# EAGLE design B113A (EAGLE 6.6.0)
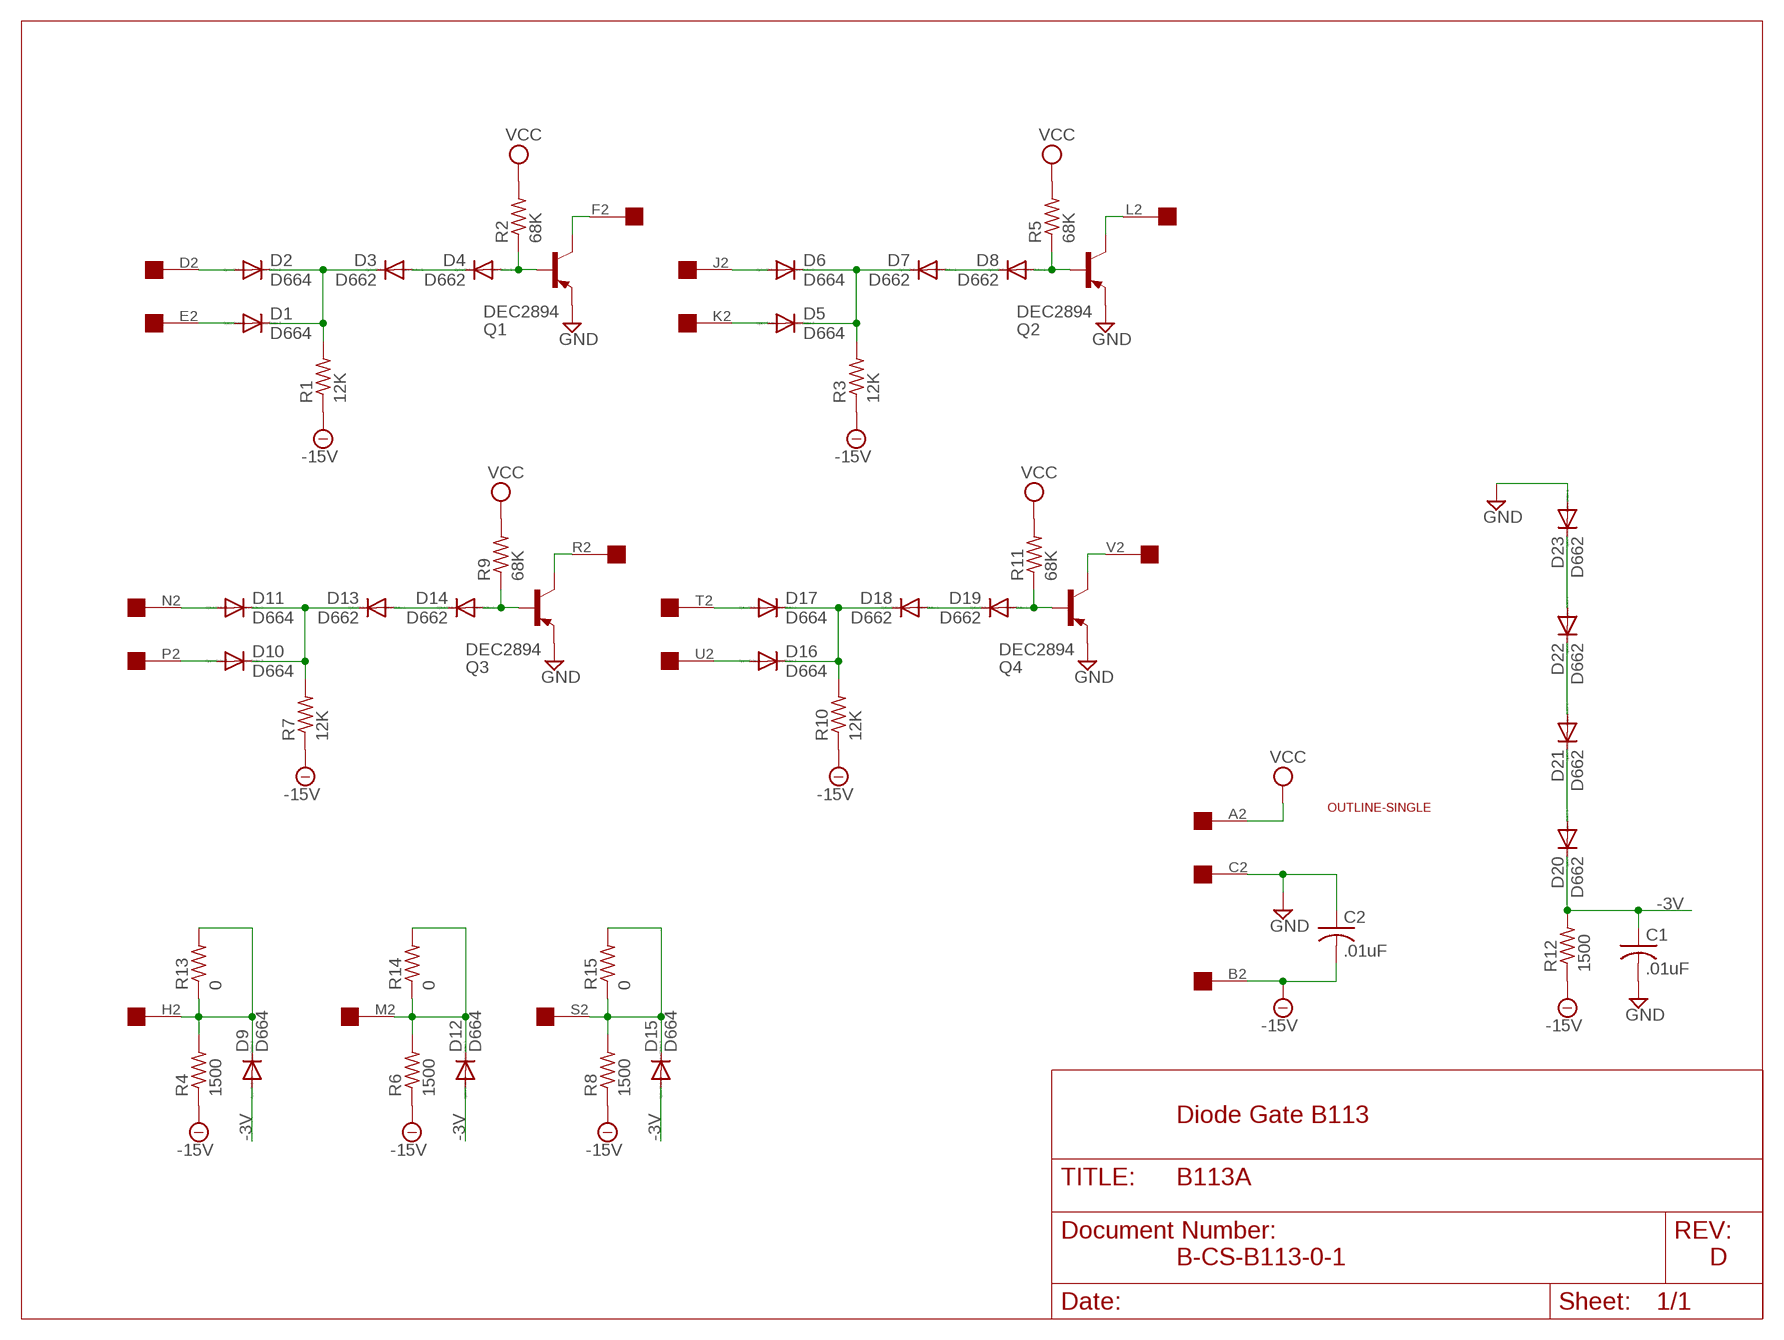
[diagram p0: schematic, sheet 1]

## Parts
C1  .01uF  C-US  [C063-025X075]
C2  .01uF  C-US  [C063-025X075]
D1  D664  DIODE-DO35-10  [DO35-10]
D2  D664  DIODE-DO35-10  [DO35-10]
D3  D662  DIODE-DO35-10  [DO35-10]
D4  D662  DIODE-DO35-10  [DO35-10]
D5  D664  DIODE-DO35-10  [DO35-10]
D6  D664  DIODE-DO35-10  [DO35-10]
D7  D662  DIODE-DO35-10  [DO35-10]
D8  D662  DIODE-DO35-10  [DO35-10]
D9  D664  DIODE-DO35-10  [DO35-10]
D10  D664  DIODE-DO35-10  [DO35-10]
D11  D664  DIODE-DO35-10  [DO35-10]
D12  D664  DIODE-DO35-10  [DO35-10]
D13  D662  DIODE-DO35-10  [DO35-10]
D14  D662  DIODE-DO35-10  [DO35-10]
D15  D664  DIODE-DO35-10  [DO35-10]
D16  D664  DIODE-DO35-10  [DO35-10]
D17  D664  DIODE-DO35-10  [DO35-10]
D18  D662  DIODE-DO35-10  [DO35-10]
D19  D662  DIODE-DO35-10  [DO35-10]
D20  D662  DIODE-DO35-10  [DO35-10]
D21  D662  DIODE-DO35-10  [DO35-10]
D22  D662  DIODE-DO35-10  [DO35-10]
D23  D662  DIODE-DO35-10  [DO35-10]
Q1  DEC2894  -PNP-TO5  [TO5]
Q2  DEC2894  -PNP-TO5  [TO5]
Q3  DEC2894  -PNP-TO5  [TO5]
Q4  DEC2894  -PNP-TO5  [TO5]
R1  12K  R-US_0207/10  [0207/10]
R2  68K  R-US_0207/10  [0207/10]
R3  12K  R-US_0207/10  [0207/10]
R4  1500  R-US_0207/10  [0207/10]
R5  68K  R-US_0207/10  [0207/10]
R6  1500  R-US_0207/10  [0207/10]
R7  12K  R-US_0207/10  [0207/10]
R8  1500  R-US_0207/10  [0207/10]
R9  68K  R-US_0207/10  [0207/10]
R10  12K  R-US_0207/10  [0207/10]
R11  68K  R-US_0207/10  [0207/10]
R12  1500  R-US_0207/10  [0207/10]
R13  0  R-US_0207/10  [0207/10]
R14  0  R-US_0207/10  [0207/10]
R15  0  R-US_0207/10  [0207/10]
U$1  OUTLINE-SINGLE  [SINGLE]
U$2  EDGE-1  [EDGE-CON1]

## Nets
-3V: C1.1 D9.A D12.A D15.A D20.C R12.2
-15V: C2.2 R1.1 R3.1 R4.1 R6.1 R7.1 R8.1 R10.1 R12.1 U$2.B2
GND: C1.2 C2.1 D23.A Q1.1(E) Q2.1(E) Q3.1(E) Q4.1(E) U$2.C2
N$1: D2.A U$2.D2
N$2: D1.C D2.C D3.C R1.2
N$3: D3.A D4.C
N$4: D1.A U$2.E2
N$5: D4.A Q1.2(B) R2.1
N$6: Q1.3(C) U$2.F2
N$7: D9.C R4.2 R13.1 R13.2 U$2.H2
N$8: D12.C R6.2 R14.1 R14.2 U$2.M2
N$9: D15.C R8.2 R15.1 R15.2 U$2.S2
N$10: D6.A U$2.J2
N$11: D5.C D6.C D7.C R3.2
N$12: D7.A D8.C
N$13: D5.A U$2.K2
N$14: D8.A Q2.2(B) R5.1
N$15: Q2.3(C) U$2.L2
N$16: D11.A U$2.N2
N$17: D10.C D11.C D13.C R7.2
N$18: D13.A D14.C
N$19: D10.A U$2.P2
N$20: D14.A Q3.2(B) R9.1
N$21: Q3.3(C) U$2.R2
N$22: D17.A U$2.T2
N$23: D16.C D17.C D18.C R10.2
N$24: D18.A D19.C
N$25: D16.A U$2.U2
N$26: D19.A Q4.2(B) R11.1
N$27: Q4.3(C) U$2.V2
N$28: D22.A D23.C
N$29: D21.A D22.C
N$31: D20.A D21.C
VCC: R2.2 R5.2 R9.2 R11.2 U$2.A2

## Notes on the sheet
- Diode Gate B113
- B-CS-B113-0-1 | D

## Library data of the parts
C1 C2 = dec-con:C-US: Capacitors with funky DEC lead spacing.
D1-D23 = diode:DIODE-: DIODE
Q1-Q4 = transistor:*-PNP-: PNP Transistror
R1-R15 = rcl:R-US_: RESISTOR, American symbol
U$1 = dec-con:OUTLINE-*: Board outlines for DEC boards.
U$2 = dec-con:EDGE-1: Single-Sided DEC Edge Connector -- (side 2)

## Net classes
0 default: width 0.813 mm

## Board
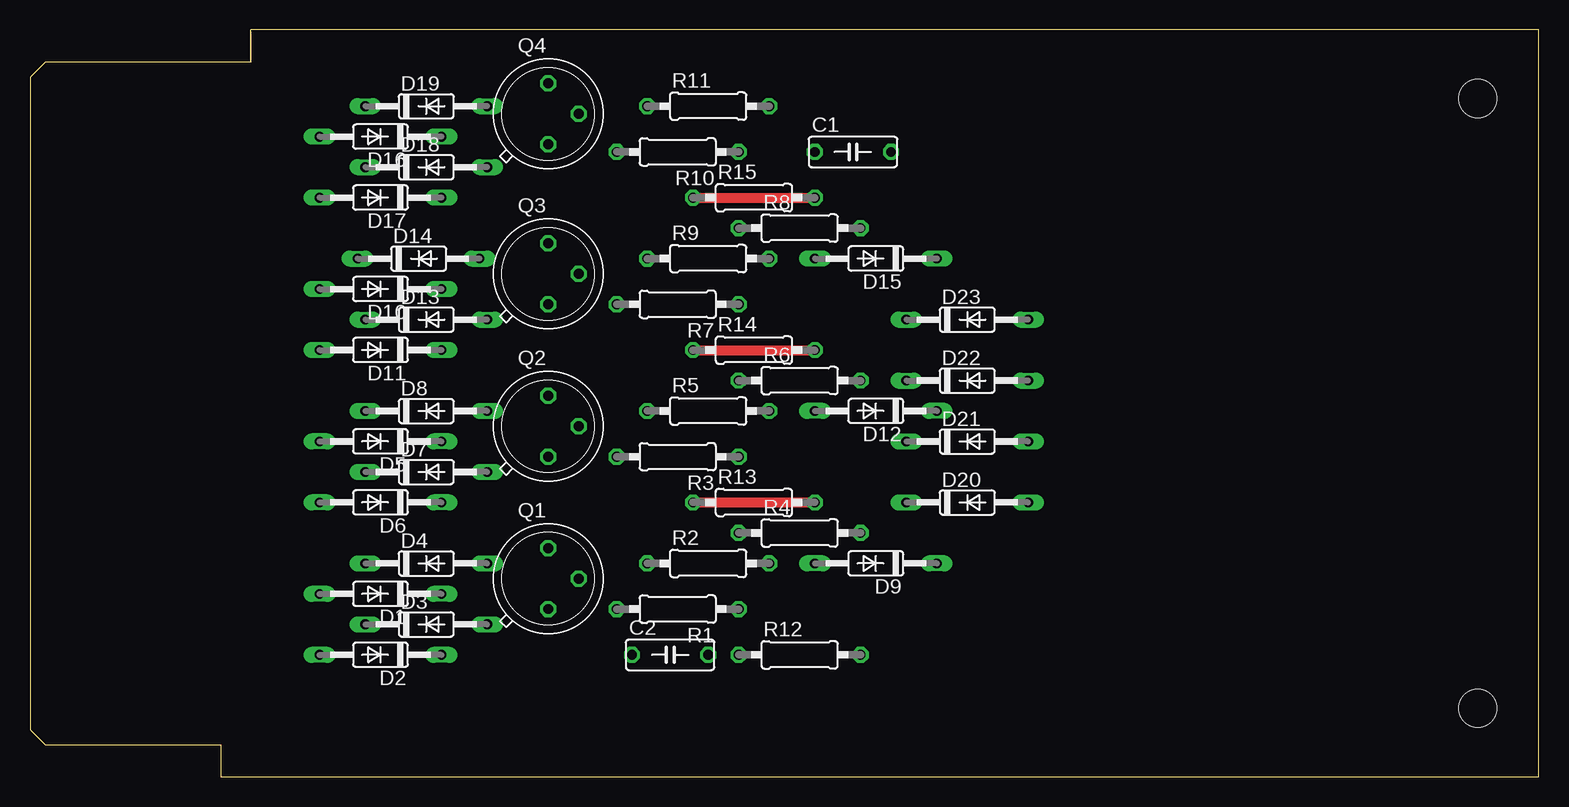
[diagram p1: board, top side]
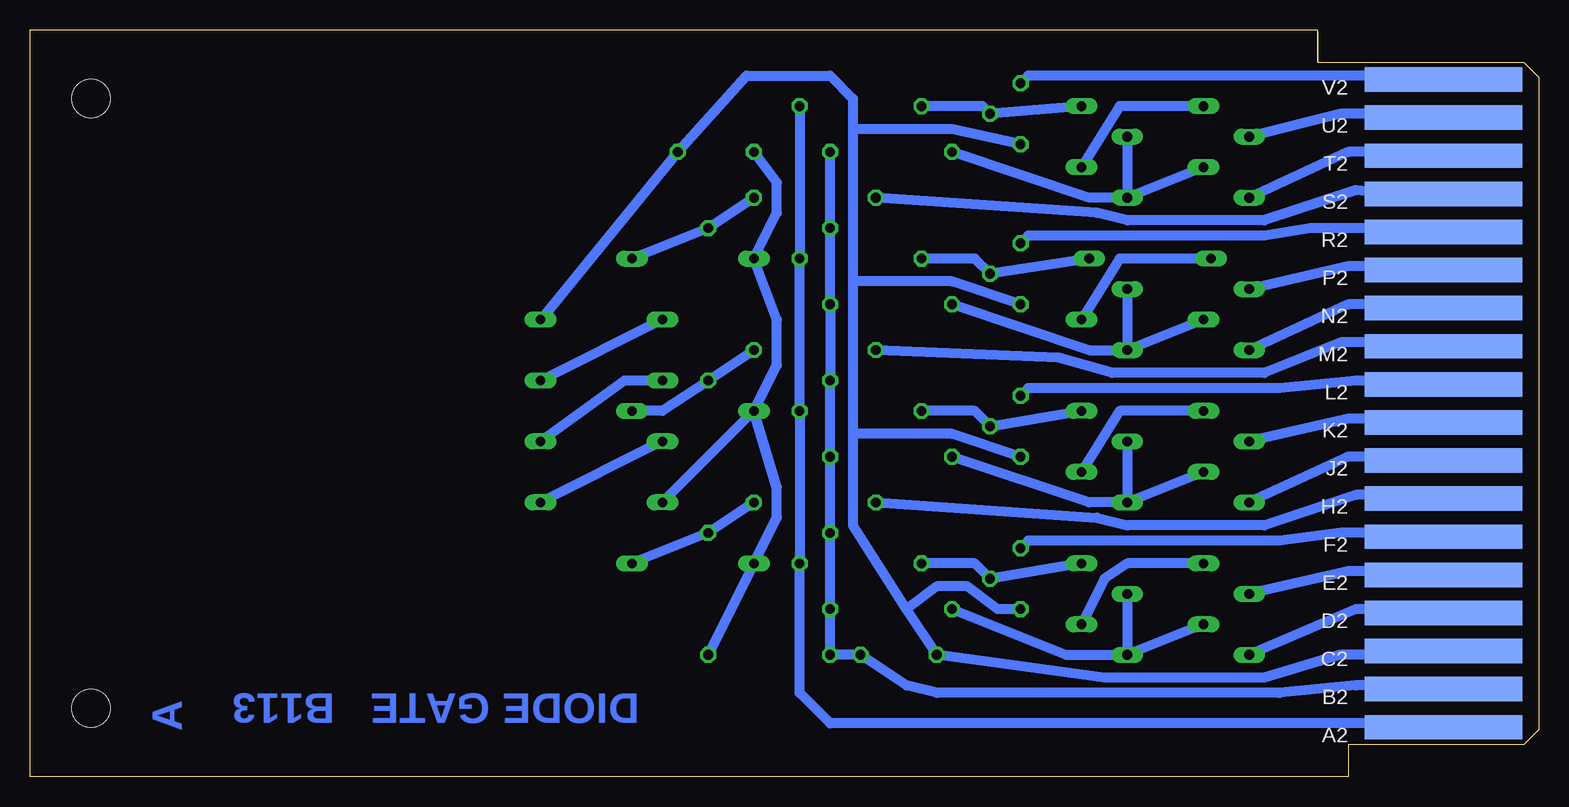
[diagram p2: board, bottom side, seen from below]

Size 125.73 x 62.23 mm. Coordinates in mm from the lower left corner, seen from the top.
Copper layers (1+16): Top 0.035mm / dielectric 1.5mm / Bottom 0.035mm
Design rules "16mils": minimum track width 16mil, minimum drill 32mil, track to track 15mil, track to pad 10mil, pad to pad 10mil, via to via 10mil, smd to smd 10mil, copper to edge 13mil, drill to drill 10mil, minimum pad ring 10mil, minimum via ring 8mil, stop-mask expansion 0mil, vias tented up to drill 0mil, thermal gap 10mil

### Footprints (pad centres in the part's own frame; a part is rotated, then mirrored left to right if it is on the bottom)
C063-025X075 = drill 0.813 octagon: 1 -2.54,0; 2 3.81,0
DO35-10 = drill 0.813 long: A 5.08,0; C -5.08,0
TO5 = drill 0.813 octagon: 1 0,-2.54; 2 2.54,0; 3 0,2.54
0207/10 = drill 0.813 octagon: 1 -5.08,0; 2 5.08,0
SINGLE = hole 3.175: 120.65,56.515; 120.65,5.715
EDGE-CON1 = smd 13.106 x 2.032 bottom: A2 7.938,4.128; B2 7.938,7.303; C2 7.938,10.477; D2 7.938,13.652; E2 7.938,16.828; F2 7.938,20.003; H2 7.938,23.177; J2 7.938,26.352; K2 7.938,29.527; L2 7.938,32.703; M2 7.938,35.877; N2 7.938,39.053; P2 7.938,42.227; R2 7.938,45.403; S2 7.938,48.578; T2 7.938,51.752; U2 7.938,54.928; V2 7.938,58.102

### Placement (x,y rotation side)
C1  67.95,52.07 0 top
C2  52.71,10.16 0 top
D1  29.21,15.24 180 top
D2  29.21,10.16 180 top
D3  33.02,12.7 0 top
D4  33.02,17.78 0 top
D5  29.21,27.94 180 top
D6  29.21,22.86 180 top
D7  33.02,25.4 0 top
D8  33.02,30.48 0 top
D9  70.49,17.78 180 top
D10  29.21,40.64 180 top
D11  29.21,35.56 180 top
D12  70.49,30.48 180 top
D13  33.02,38.1 0 top
D14  32.39,43.18 0 top
D15  70.49,43.18 180 top
D16  29.21,53.34 180 top
D17  29.21,48.26 180 top
D18  33.02,50.8 0 top
D19  33.02,55.88 0 top
D20  78.11,22.86 0 top
D21  78.11,27.94 0 top
D22  78.11,33.02 0 top
D23  78.11,38.1 0 top
Q1  43.18,16.51 0 top
Q2  43.18,29.21 0 top
Q3  43.18,41.91 0 top
Q4  43.18,55.24 0 top
R1  53.98,13.97 180 top
R2  56.52,17.78 0 top
R3  53.98,26.67 180 top
R4  64.14,20.32 0 top
R5  56.52,30.48 0 top
R6  64.14,33.02 0 top
R7  53.98,39.37 180 top
R8  64.14,45.72 0 top
R9  56.52,43.18 0 top
R10  53.98,52.07 180 top
R11  56.52,55.88 0 top
R12  64.14,10.16 0 top
R13  60.33,22.86 0 top
R14  60.33,35.56 0 top
R15  60.33,48.26 0 top
U$1  0,0 0 top
U$2  0,0 0 top

### Tracks (layer width: path | path; a pad name or v marks a point on that pad's centre or on a via)
-3V
  Bottom 0.813: D20.C D12.A | D12.A 63.5,34.29 63.5,38.1 D15.A 63.5,46.99 63.5,49.53 C1.1 | D12.A 63.5,24.13 63.5,21.59 D9.A R12.2
-15V
  Bottom 0.813: U$2.B2 8.89,7.62 15.24,7.62 21.59,6.99 50.17,6.99 52.71,7.62 C2.2 R12.1 R1.1 R4.1 R3.1 R6.1 R7.1 R8.1 R10.1
GND
  Bottom 0.813: D23.A C1.2 66.04,58.42 59.06,58.42 57.15,56.52 57.15,53.98 | Q1.1 45.09,13.97 47.63,15.88 50.17,15.88 52.71,13.97 | 52.71,13.97 C2.1 36.2,8.26 22.86,8.26 16.51,10.16 8.89,10.16 U$2.C2 | Q4.1 48.9,53.98 57.15,53.98 | 57.15,53.98 57.15,41.27 | 57.15,41.27 57.15,28.57 | 57.15,28.57 57.15,20.95 52.71,13.97 | Q3.1 48.9,41.27 57.15,41.27 | Q2.1 48.9,28.57 57.15,28.57
N$1
  Bottom 0.813: U$2.D2 8.89,13.97 15.24,13.97 D2.A
N$2
  Bottom 0.813: D3.C D2.C | D1.C D2.C | R1.2 39.37,10.16 D2.C
N$3
  Bottom 0.813: D4.C 34.29,17.78 36.2,16.51 D3.A
N$4
  Bottom 0.813: U$2.E2 8.89,17.14 15.88,17.14 D1.A
N$5
  Bottom 0.813: D4.A Q1.2 46.99,17.78 R2.1
N$6
  Bottom 0.813: U$2.F2 8.89,20.32 16.51,20.32 21.59,19.68 42.55,19.68 Q1.3
N$7
  Top 0.813: R13.1 R13.2
  Bottom 0.813: R13.2 R4.2 D9.C | U$2.H2 8.26,23.5 15.24,23.5 22.86,20.95 34.29,20.95 36.83,21.59 R13.1
N$8
  Top 0.813: R14.1 R14.2
  Bottom 0.813: R14.2 R6.2 73.03,30.48 D12.C | U$2.M2 8.26,36.2 16.51,36.2 22.86,33.66 35.56,33.66 40.01,34.92 R14.1
N$9
  Top 0.813: R15.1 R15.2
  Bottom 0.813: U$2.S2 8.26,48.26 15.24,48.9 22.86,46.35 34.29,46.35 36.83,46.99 R15.1 | R15.2 R8.2 D15.C
N$10
  Bottom 0.813: U$2.J2 9.53,26.67 15.88,26.67 D6.A
N$11
  Bottom 0.813: D6.C 37.47,22.86 R3.2 | D5.C D6.C | D6.C D7.C
N$12
  Bottom 0.813: D8.C 34.93,30.48 D7.A
N$13
  Bottom 0.813: U$2.K2 8.89,29.84 15.88,29.84 D5.A
N$14
  Bottom 0.813: R5.1 46.99,30.48 Q2.2 D8.A
N$15
  Bottom 0.813: U$2.L2 8.89,33.02 15.24,33.02 21.59,32.38 42.55,32.38 Q2.3
N$16
  Bottom 0.813: U$2.N2 8.89,39.37 15.88,39.37 D11.A
N$17
  Bottom 0.813: D13.C D11.C | D10.C D11.C | R7.2 37.47,35.56 D11.C
N$18
  Bottom 0.813: D14.C 34.93,43.18 D13.A
N$19
  Bottom 0.813: U$2.P2 8.26,42.55 15.88,42.55 D10.A
N$20
  Bottom 0.813: R9.1 46.99,43.18 Q3.2 D14.A
N$21
  Bottom 0.813: U$2.R2 8.89,45.72 19.05,45.72 22.86,45.09 42.55,45.09 Q3.3
N$22
  Bottom 0.813: U$2.T2 8.89,52.07 15.88,52.07 D17.A
N$23
  Bottom 0.813: D18.C D17.C | D17.C 37.47,48.26 R10.2 | D16.C D17.C
N$24
  Bottom 0.813: D19.C 34.93,55.88 D18.A
N$25
  Bottom 0.813: U$2.U2 9.53,55.24 16.51,55.24 D16.A
N$26
  Bottom 0.813: R11.1 46.36,55.88 Q4.2 D19.A
N$27
  Bottom 0.813: U$2.V2 8.26,58.1 8.26,58.42 42.55,58.42 Q4.3
N$28
  Bottom 0.813: D23.C D22.A
N$29
  Bottom 0.813: D22.C 76.2,33.02 D21.A
N$31
  Bottom 0.813: D21.C D20.A
VCC
  Bottom 0.813: U$2.A2 8.89,4.45 59.06,4.45 61.6,6.99 R2.2 R5.2 R9.2 R11.2

### Text on the board
Bottom: DIODE GATE | B113 | A